# EAGLE design IO_module (EAGLE 7.2.0)
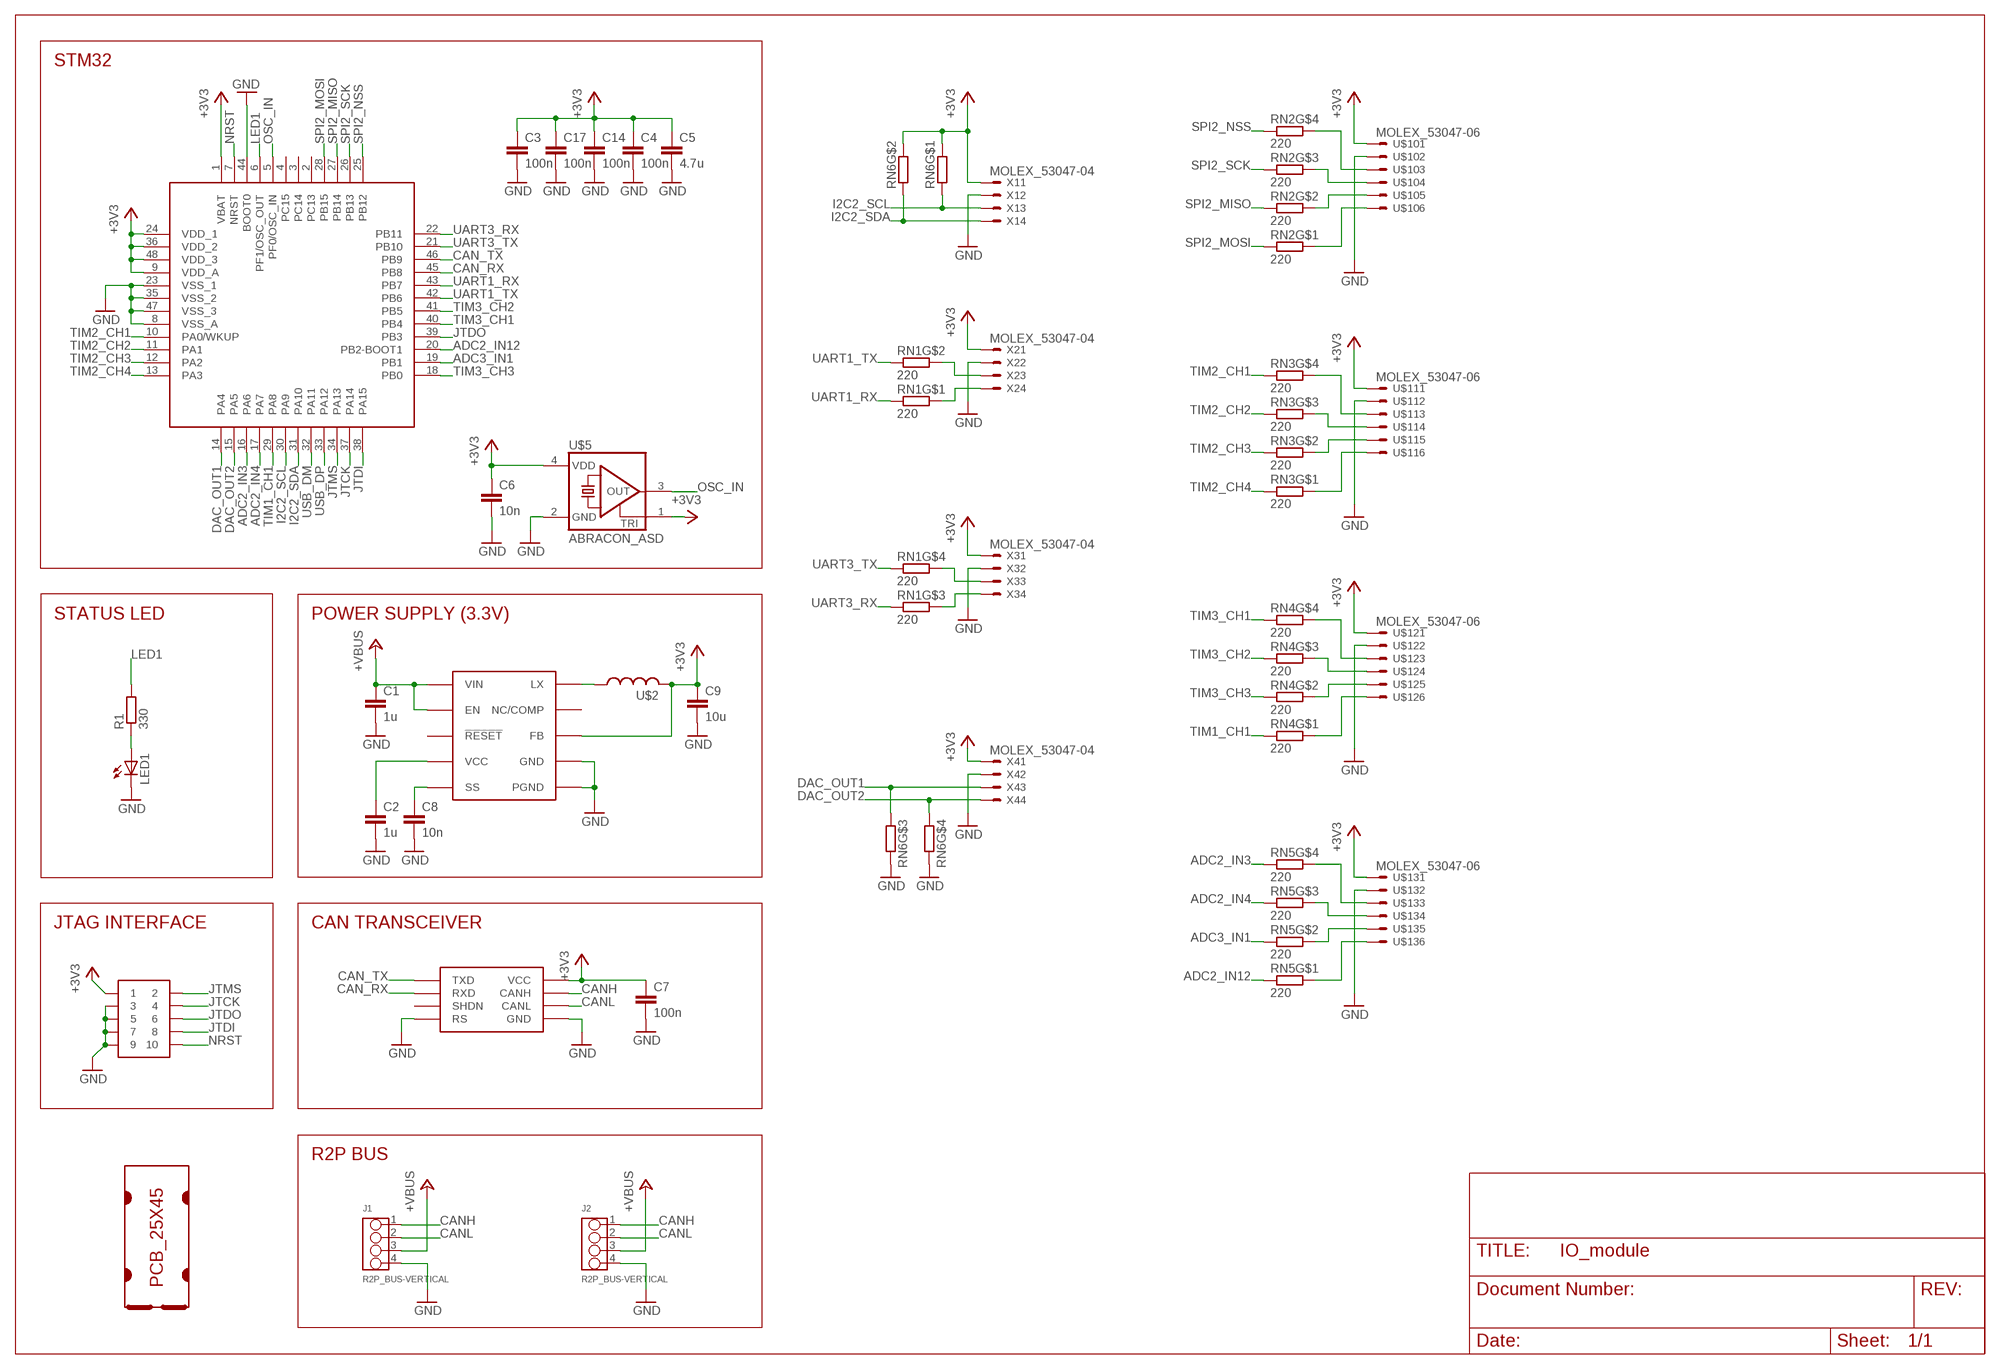
[diagram p0: schematic, sheet 1]

## Parts
C1  1u  C1206  [C1206]
C2  1u  C0603  [C0603]
C3  100n  C0603  [C0603]
C4  100n  C0603  [C0603]
C5  4.7u  C0805  [C0805]
C6  10n  C0603  [C0603]
C7  100n  C0603  [C0603]
C8  10n  C0603  [C0603]
C9  10u  C0805  [C0805]
C14  100n  C0603  [C0603]
C17  100n  C0603  [C0603]
J1  R2P_BUS-VERTICAL  [OPL-EAGLE-LIBRARY_4P-2.0]
J2  R2P_BUS-VERTICAL  [OPL-EAGLE-LIBRARY_4P-2.0]
LED1  LED0805  [CHIPLED_0805]
R1  330  R0603  [R0603]
RN1  220  RNETWORK_4-1206  [RNET4_1206]
RN2  220  RNETWORK_4-1206  [RNET4_1206]
RN3  220  RNETWORK_4-1206  [RNET4_1206]
RN4  220  RNETWORK_4-1206  [RNET4_1206]
RN5  220  RNETWORK_4-1206  [RNET4_1206]
RN6  RNETWORK_4-1206  [RNET4_1206]
SOT1  MAX3051EKA  [SOT23-8L]
U$1  PCB_25X45  [25X45]
U$2  LPS4018  [COILCRAFT_LPS4018]
U$3  MAX17501  [TDFN-10]
U$4  JTAG-TH  [SAMTEC_FTSH-105-TH]
U$5  ABRACON_ASD  [ABRACON_2.5X2]
U$6  STM32F303CTX  [LQFP48]
U$10  MOLEX_53047-06  [MOLEX_53047-06]
U$11  MOLEX_53047-06  [MOLEX_53047-06]
U$12  MOLEX_53047-06  [MOLEX_53047-06]
U$13  MOLEX_53047-06  [MOLEX_53047-06]
X1  MOLEX_53047-04  [MOLEX_53047-04]
X2  MOLEX_53047-04  [MOLEX_53047-04]
X3  MOLEX_53047-04  [MOLEX_53047-04]
X4  MOLEX_53047-04  [MOLEX_53047-04]

## Nets
+3V3: C3.1 C4.1 C5.1 C6.1 C7.1 C9.1 C14.1 C17.1 RN6.7 RN6.8 SOT1.3(VCC) U$2.P$2 U$3.P$5(FB) U$4.1 U$5.1(TRI) U$5.4(VDD) U$6.1(VBAT) U$6.9(VDD_A) U$6.24(VDD_1) U$6.36(VDD_2) U$6.48(VDD_3) U$10.1 U$11.1 U$12.1 U$13.1 X1.1 X2.1 X3.1 X4.1
+VBUS: C1.1 J1.3 J2.3 U$3.P$2(VIN) U$3.P$3(EN)
ADC2_IN3: RN5.4 U$6.16(PA6)
ADC2_IN4: RN5.3 U$6.17(PA7)
ADC2_IN12: RN5.1 U$6.20(PB2-BOOT1)
ADC3_IN1: RN5.2 U$6.19(PB1)
CAN_RX: SOT1.4(RXD) U$6.45(PB8)
CAN_TX: SOT1.1(TXD) U$6.46(PB9)
CANH: J1.1 J2.1 SOT1.7(CANH)
CANL: J1.2 J2.2 SOT1.6(CANL)
DAC_OUT1: RN6.3 U$6.14(PA4) X4.3
DAC_OUT2: RN6.4 U$6.15(PA5) X4.4
GND: C1.2 C2.2 C3.2 C4.2 C5.2 C6.2 C7.2 C8.2 C9.2 C14.2 C17.2 J1.4 J2.4 LED1.C RN6.5 RN6.6 SOT1.2(GND) SOT1.8(RS) U$3.P$1(PGND) U$3.P$9(GND) U$3.P$11(PGND) U$4.3 U$4.5 U$4.7 U$4.9 U$5.2(GND) U$6.8(VSS_A) U$6.23(VSS_1) U$6.35(VSS_2) U$6.44(BOOT0) U$6.47(VSS_3) U$10.2 U$11.2 U$12.2 U$13.2 X1.2 X2.2 X3.2 X4.2
I2C2_SCL: RN6.1 U$6.30(PA9) X1.3
I2C2_SDA: RN6.2 U$6.31(PA10) X1.4
JTCK: U$4.4 U$6.37(PA14)
JTDI: U$4.8 U$6.38(PA15)
JTDO: U$4.6 U$6.39(PB3)
JTMS: U$4.2 U$6.34(PA13)
LED1: R1.2 U$6.6(PF1/OSC_OUT)
N$1: U$2.P$1 U$3.P$10(LX)
N$3: RN1.5 X3.3
N$4: LED1.A R1.1
N$5: RN1.7 X2.3
N$6: RN1.8 X2.4
N$7: C2.1 U$3.P$4(VCC)
N$8: C8.1 U$3.P$6(SS)
N$11: RN1.6 X3.4
N$12: RN2.8 U$10.6
N$13: RN2.7 U$10.5
N$14: RN2.6 U$10.4
N$15: RN2.5 U$10.3
N$18: RN5.8 U$13.6
N$19: RN5.7 U$13.5
N$20: RN5.6 U$13.4
N$21: RN5.5 U$13.3
N$22: RN4.5 U$12.3
N$23: RN4.6 U$12.4
N$24: RN4.7 U$12.5
N$25: RN4.8 U$12.6
N$26: RN3.5 U$11.3
N$27: RN3.6 U$11.4
N$28: RN3.7 U$11.5
N$29: RN3.8 U$11.6
NRST: U$4.10 U$6.7(NRST)
OSC_IN: U$5.3(OUT) U$6.5(PF0/OSC_IN)
SPI2_MISO: RN2.2 U$6.27(PB14)
SPI2_MOSI: RN2.1 U$6.28(PB15)
SPI2_NSS: RN2.4 U$6.25(PB12)
SPI2_SCK: RN2.3 U$6.26(PB13)
TIM1_CH1: RN4.1 U$6.29(PA8)
TIM2_CH1: RN3.4 U$6.10(PA0/WKUP)
TIM2_CH2: RN3.3 U$6.11(PA1)
TIM2_CH3: RN3.2 U$6.12(PA2)
TIM2_CH4: RN3.1 U$6.13(PA3)
TIM3_CH1: RN4.4 U$6.40(PB4)
TIM3_CH2: RN4.3 U$6.41(PB5)
TIM3_CH3: RN4.2 U$6.18(PB0)
UART1_RX: RN1.1 U$6.43(PB7)
UART1_TX: RN1.2 U$6.42(PB6)
UART3_RX: RN1.3 U$6.22(PB11)
UART3_TX: RN1.4 U$6.21(PB10)
USB_DM: U$6.32(PA11)
USB_DP: U$6.33(PA12)
Unconnected: SOT1.5(SHDN) U$3.P$7(NC/COMP) U$3.P$8(!RESET) U$6.2(PC13) U$6.3(PC14) U$6.4(PC15)

## Notes on the sheet
- STM32
- STATUS LED | POWER SUPPLY (3.3V)
- JTAG INTERFACE | CAN TRANSCEIVER
- R2P BUS

## Library data of the parts
C1-C9 C14 C17 = r2p_rcl:C
J1 J2 = r2p_connector:R2P_BUS
LED1 = r2p_led:LED
R1 = r2p_rcl:R
RN1-RN6 = r2p_rcl:RNETWORK_4: 4 Resistor Array 0603
SOT1 = r2p_ic:MAX3051
U$1 = r2p_pcb:PCB_25X45
U$2 = r2p_rcl:LPS4018
U$3 = r2p_ic:MAX17501
U$4 = r2p_connector:JTAG
U$5 = r2p_ic:ABRACON_ASD
U$6 = r2p_ic:STM32F303C
U$10-U$13 = r2p_connector:MOLEX_53?-06
X1-X4 = r2p_connector:MOLEX_53?-04: CONNECTOR wire to board 1.25 mm (.049 inch) pitch header; MF: WALDOM/MOLEX; MPN: 53047-0410; OC_FARNELL: 9733060; OC_NEWARK: 38C9900

## Board
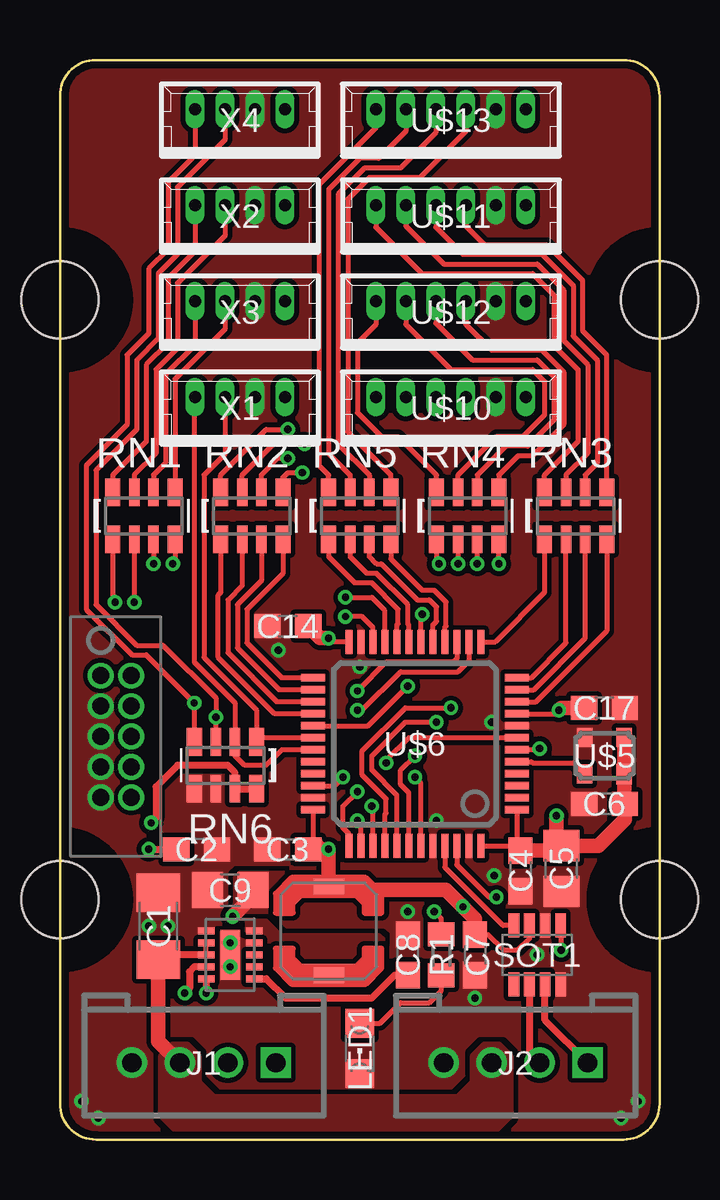
[diagram p1: board, top side]
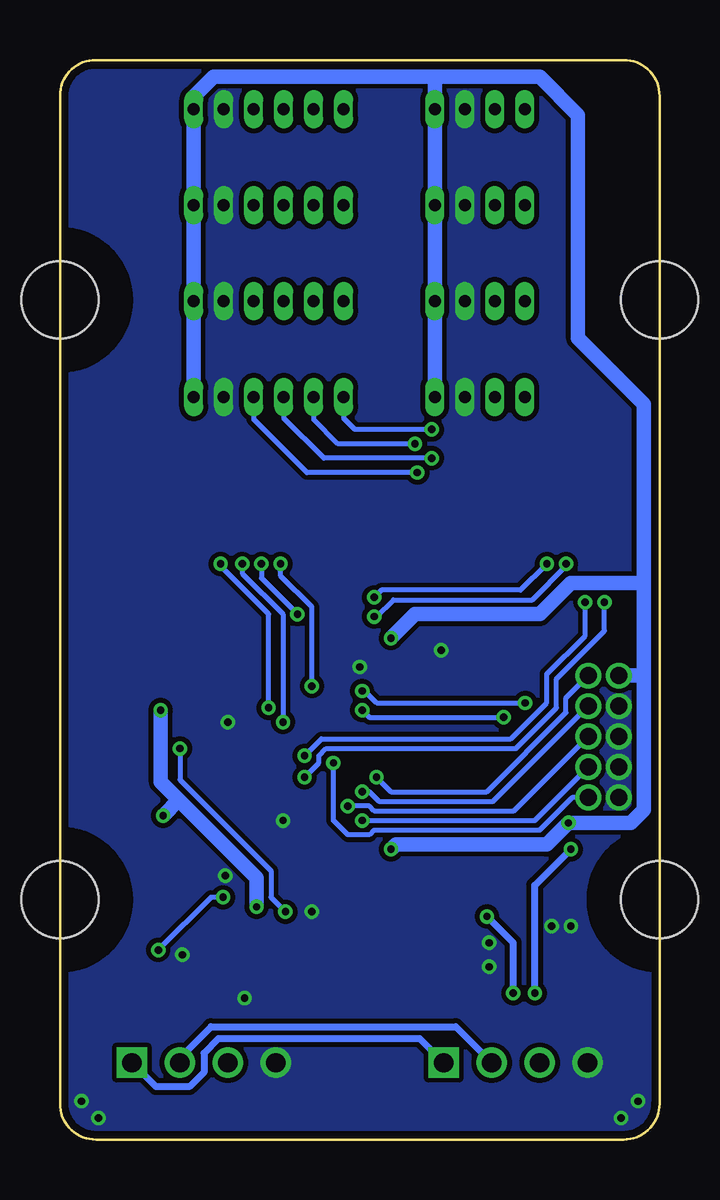
[diagram p2: board, bottom side, seen from below]

Size 25 x 45 mm. Coordinates in mm from the lower left corner, seen from the top.
Copper layers (1*16): Top 0.035mm / dielectric 1.5mm / Bottom 0.035mm
Design rules "2layer_0.2mm": minimum track width 0.2mm, minimum drill 0.3mm, track to track 0.2mm, track to pad 0.2mm, pad to pad 0.2mm, via to via 0.2mm, smd to smd 0mil, copper to edge 0.3mm, drill to drill 0.3mm, minimum pad ring 0.15mm, minimum via ring 0.15mm, stop-mask expansion 0.05mm, vias tented up to drill 2.5mm, thermal gap 0.25mm
tRestrict: 2 lines

### Footprints (pad centres in the part's own frame; a part is rotated, then mirrored left to right if it is on the bottom)
C1206 = smd 1.6 x 1.8: 1 -1.4,0; 2 1.4,0
C0603 = smd 1.1 x 1: 1 -0.85,0; 2 0.85,0
C0805 = smd 1.3 x 1.5: 1 -0.95,0; 2 0.95,0
OPL-EAGLE-LIBRARY_4P-2.0 = drill 0.8 pad 1.27 square: 1 -3,0 | drill 0.8 pad 1.27: 2 -1,0; 3 1,0; 4 3,0
CHIPLED_0805 = smd 1.2 x 1.2: A 0,-1.05; C 0,1.05
R0603 = smd 1 x 1.1: 1 -0.85,0; 2 0.85,0
RNET4_1206 = smd 0.63 x 1.15: 1 -1.295,-0.975; 4 1.295,-0.975; 5 1.295,0.975; 8 -1.295,0.975 | smd 0.44 x 1.15: 2 -0.4,-0.975; 3 0.4,-0.975; 6 0.4,0.975; 7 -0.4,0.975
SOT23-8L = smd 0.45 x 1: 1 -0.975,-1.225; 2 -0.325,-1.225; 3 0.325,-1.225; 4 0.975,-1.225; 5 0.975,1.225; 6 0.325,1.225; 7 -0.325,1.225; 8 -0.975,1.225
25X45 = hole 3.2: 0,10; 25,10; 0,35; 25,35
COILCRAFT_LPS4018 = smd 0.635 x 1.27: P$1 -1.85,0; P$2 1.85,0
TDFN-10 = smd 0.7 x 0.3: P$1 -1,1; P$2 -1,0.5; P$3 -1,0; P$4 -1,-0.5; P$5 -1,-1; P$6 1,-1; P$7 1,-0.5; P$8 1,0; P$9 1,0.5; P$10 1,1 | smd 0.8 x 2.08: P$11 0,0
SAMTEC_FTSH-105-TH = drill 0.711 pad 1.016: 1 -2.54,0; 2 -2.54,1.27; 3 -1.27,0; 4 -1.27,1.27; 5 0,0; 6 0,1.27; 7 1.27,0; 8 1.27,1.27; 9 2.54,0; 10 2.54,1.27
ABRACON_2.5X2 = smd 0.65 x 0.8: 1 -0.825,-0.762; 2 0.825,-0.762; 3 0.825,0.762 | smd 0.65 x 0.85: 4 -0.825,0.762
LQFP48 = smd 1 x 0.3: 1 -4.25,2.75; 2 -4.25,2.25; 3 -4.25,1.75; 4 -4.25,1.25; 5 -4.25,0.75; 6 -4.25,0.25; 7 -4.25,-0.25; 8 -4.25,-0.75; 9 -4.25,-1.25; 10 -4.25,-1.75; 11 -4.25,-2.25; 12 -4.25,-2.75; 25 4.25,-2.75; 26 4.25,-2.25; 27 4.25,-1.75; 28 4.25,-1.25; 29 4.25,-0.75; 30 4.25,-0.25; 31 4.25,0.25; 32 4.25,0.75; 33 4.25,1.25; 34 4.25,1.75; 35 4.25,2.25; 36 4.25,2.75 | smd 0.3 x 1: 13 -2.75,-4.25; 14 -2.25,-4.25; 15 -1.75,-4.25; 16 -1.25,-4.25; 17 -0.75,-4.25; 18 -0.25,-4.25; 19 0.25,-4.25; 20 0.75,-4.25; 21 1.25,-4.25; 22 1.75,-4.25; 23 2.25,-4.25; 24 2.75,-4.25; 37 2.75,4.25; 38 2.25,4.25; 39 1.75,4.25; 40 1.25,4.25; 41 0.75,4.25; 42 0.25,4.25; 43 -0.25,4.25; 44 -0.75,4.25; 45 -1.25,4.25; 46 -1.75,4.25; 47 -2.25,4.25; 48 -2.75,4.25
MOLEX_53047-06 = drill 0.5 pad 0.698 long: 1 3.125,0.45; 2 1.875,0.45; 3 0.625,0.45; 4 -0.625,0.45; 5 -1.875,0.45; 6 -3.125,0.45
MOLEX_53047-04 = drill 0.5 pad 0.698 long: 1 1.875,0.45; 2 0.625,0.45; 3 -0.625,0.45; 4 -1.875,0.45

### Placement (x,y rotation side)
C1  4.1,8.9 90 top
C2  5.7,12.1 0 top
C3  9.5,12.1 180 top
C4  19.2,11.2 270 top
C5  20.9,11.3 270 top
C6  22.7,14 180 top
C7  17.3,7.7 270 top
C8  14.5,7.7 90 top
C9  7.1,10.4 180 top
C14  9.5,21.4 180 top
C17  22.7,18 0 top
J1  6,3.2 180 top
J2  19,3.2 180 top
LED1  12.5,3.8 180 top
R1  15.9,7.7 90 top
RN1  3.5,26 0 top
RN2  8,26 0 top
RN3  21.5,26 0 top
RN4  17,26 0 top
RN5  12.5,26 0 top
RN6  6.9,15.6 180 top
SOT1  19.9,7.7 180 top
U$1  0,0 0 top
U$2  11.2,8.7 90 top
U$3  7.1,7.7 0 top
U$4  1.7,16.8 270 top
U$5  22.7,16 180 top
U$6  14.8,16.5 180 top
U$10  16.3,30.5 0 top
U$11  16.3,38.5 0 top
U$12  16.3,34.5 0 top
U$13  16.3,42.5 0 top
X1  7.5,30.5 0 top
X2  7.5,38.5 0 top
X3  7.5,34.5 0 top
X4  7.5,42.5 0 top

### Tracks (layer width: path | path; a pad name or v marks a point on that pad's centre or on a via)
+3V3  (via drill 0.3)
  Top 0.2: C7.1 17.85,8.55 18.5,7.9 19.1,7.9 19.57,8.38 SOT1.3 | U$6.36 10.55,12.3 C3.1 | U$6.48 19,12.25 19.05,12.2 | U$6.1 19.05,12.2 | 19.05,12.2 C4.1 | U$6.24 11.35,20.75 v11.2,20.9 | U$6.9 20.65,17.75 v20.8,17.9 | C17.1 22,18
  Top 0.3: U$3.P$5 v6.1,6.1 | v3.8,13.2 4,13.4 4,14.7 4.9,15.6 7,15.6 7.3,15.3 RN6.7 RN6.8
  Top 0.6: 10.55,12.3 10.7,12.3 | C7.1 17.3,9.2 v16.8,9.7 16.1,10.4 12.6,10.4 | C3.1 v11.2,12.1 U$2.P$2 | U$5.1 U$5.4 23.52,14.03 C6.1 23.55,13.35 22.45,12.25 C5.1 | C4.1 20.7,12.05 C5.1 | 19.05,12.2 19.05,12.05 19,12 | C17.1 20.9,18 v20.8,17.9 | C5.1 20.7,12.45 v20.7,13.5 | v7.2,9.3 8.05,10.15 C9.1 | C14.1 10.85,20.9 v11.2,20.9
  Bottom 0.3: v6.1,6.1 6.1,8.2 v7.2,9.3
  Bottom 0.6: v11.2,12.1 11,12.3 4.7,12.3 v3.8,13.2 1.2,13.2 0.65,13.75 0.65,19.4 | 20.05,14.15 16.8,10.9 v16.8,9.7 | v20.7,13.5 20.05,14.15 | 20.05,14.15 20.8,14.9 v20.8,17.9 | 0.65,19.4 0.65,23.2 | 0.65,23.2 0.65,30.65 3.4,33.4 3.4,42.7 5,44.3 9.4,44.3 | 9.4,44.3 18.6,44.3 19.43,43.48 U$13.1 U$11.1 U$12.1 U$10.1 | 9.4,44.3 9.38,44.27 X4.1 X2.1 X3.1 X1.1 | U$4.1 0.71,19.34 0.65,19.4 | v11.2,20.9 10.2,21.9 5,21.9 3.7,23.2 0.65,23.2
  pour Top (rank 5, no thermals): 13.3,8.9 13.5,9.1 13.5,10.3 12.8,11 9.5,11 9.4,11.1 7.5,11.1 7.3,10.9 7.3,9.8 8.3,8.9
+VBUS
  Top 0.2: U$3.P$3 U$3.P$2
  Top 0.3: U$3.P$3 4.3,7.7 C1.1
  Top 0.6: C1.1 4.1,4.1 J1.3
  pour Top (no thermals): 4.7,4 5.3,4 5.8,3.5 5.8,2.4 6.4,1.8 16.6,1.8 17.2,2.4 17.2,3.5 17.7,4 18.3,4 18.8,3.5 18.8,1 17.8,0 5.2,0 4.2,1 4.2,3.5
ADC2_IN3
  Top 0.2: U$6.16 16.05,21.35 16.1,21.4 16.1,22.4 15.6,22.9 15.1,22.9 13.79,24.2 RN5.4
ADC2_IN4
  Top 0.2: U$6.17 15.55,21.45 15.7,21.6 15.7,22.2 15.4,22.5 14.9,22.5 13.4,24 13.2,24 12.9,24.3 RN5.3
ADC2_IN12
  Top 0.2: RN5.1 11.21,24.3 12.3,23.2 13,23.2 14.1,22.1 14.1,21.5 14.05,21.45 U$6.20
ADC3_IN1
  Top 0.2: U$6.19 14.55,21.45 14.5,21.5 14.5,22.3 13.2,23.6 12.8,23.6 12.1,24.3 RN5.2
CAN_RX
  Top 0.2: U$6.45 16.05,11.35 18.4,9 18.48,8.93 SOT1.4
CAN_TX  (via drill 0.3)
  Top 0.2: U$6.46 16.55,11.45 17.9,10.1 v18.2,10.1 | SOT1.1 20.88,7.92 v20.9,7.9
  Bottom 0.2: v18.2,10.1 18.7,10.1 v20.9,7.9
CANH
  Top 0.3: J2.1 20.23,4.97 SOT1.7
  Bottom 0.3: J1.1 10,4.2 18.4,4.2 19,3.6 19,2.8 19.6,2.2 21,2.2 J2.1
CANL
  Top 0.3: 19.57,3.62 J2.2 19.57,3.62 | SOT1.6 19.57,3.62
  Bottom 0.3: J1.2 8.5,4.7 18.7,4.7 20,3.4 J2.2
DAC_OUT1  (via drill 0.3)
  Top 0.2: X4.3 6.88,41.67 4.9,39.7 4.9,36.9 4.1,36.1 4.1,33.4 3.2,32.5 3.2,29.6 1.5,27.9 1.5,22.3 3.2,20.6 4.3,20.6 6.5,18.4 v6.5,17.6 RN6.3 | U$6.14 17.05,19.95 16.6,19.5 14.2,19.5 12.6,17.9 v12.4,17.9
  Bottom 0.2: v12.4,17.9 12.1,17.6 v6.5,17.6
DAC_OUT2  (via drill 0.3)
  Top 0.2: X4.4 5.62,41.02 4.5,39.9 4.5,37.1 3.7,36.3 3.7,33.6 2.8,32.7 2.8,29.8 1.1,28.1 1.1,22.1 3,20.2 3.6,20.2 v5.6,18.2 v5.61,18.2 RN6.4 | U$6.15 16.55,20.05 16.4,19.9 13.6,19.9 v12.4,18.7
  Bottom 0.2: v12.4,18.7 12.3,18.7 11.8,18.2 v5.6,18.2
GND  (via drill 0.3)
  other vias: 7.1,8.2 7.1,7.2 4.5,8.9 3.7,8.9 17.3,5.9 19.9,7.7 24.1,1.6 23.4,0.9 1.6,0.9 0.9,1.6 18,17.4 18.1,11 14.5,9.5 12.5,19.7 15.7,13.3 9.1,20.4
  pour Bottom (rank 6, no thermals): 0,0 25,0 25,45 0,45
  pour Top (rank 6, no thermals): 0,0 25,0 25,45 0,45
I2C2_SCL
  Top 0.2: X1.3 6.88,28.57 6,27.7 6,20.1 8.2,17.91 RN6.1 8.37,16.75 U$6.30
I2C2_SDA
  Top 0.2: X1.4 5.6,30.93 5.6,19.9 7.3,18.2 RN6.2 7.3,16 7.7,15.6 8.6,15.6 9.25,16.25 U$6.31
JTCK  (via drill 0.3)
  Top 0.2: U$6.37 12.05,12.75 11.8,13 11.8,13.9 v12.4,14.5
  Bottom 0.2: v12.4,14.5 12.1,14.5 11.7,14.1 6.94,14.1 U$4.4
JTDI  (via drill 0.3)
  Top 0.2: U$6.38 12.55,13.15 v12.4,13.3
  Bottom 0.2: v12.4,13.3 5.2,13.3 U$4.8
JTDO  (via drill 0.3)
  Top 0.2: U$6.39 13.05,13.85 v13,13.9
  Bottom 0.2: v13,13.9 12.1,13.9 11.9,13.7 6.07,13.7 U$4.6
JTMS  (via drill 0.3)
  Top 0.2: U$6.34 11.45,14.75 v11.8,15.1
  Bottom 0.2: v11.8,15.1 11.2,14.5 7.2,14.5 3.9,17.8 3.9,18.41 U$4.2
LED1  (via drill 0.3)
  Top 0.2: v20,16.3 19.95,16.25 U$6.6 | R1.2 15.9,9.2 v15.6,9.5
  Bottom 0.2: v20,16.3 20,15 16.2,11.2 16.2,10.1 v15.6,9.5
N$1
  pour Top (no thermals): 7.8,8.7 8.2,8.7 8.5,8.2 8.5,7.5 9.6,6.4 12.8,6.4 13.5,7.1 13.5,8.3 13.3,8.5 9.2,8.5 8.6,9.1 7.8,9.1
N$3
  Top 0.2: X3.3 6.88,33.77 4.8,31.7 RN1.5
N$4
  Top 0.2: R1.1 15.9,6.2 15.4,5.7 14.2,5.7 13.35,4.85 LED1.A
N$5
  Top 0.2: X2.3 6.88,37.67 4.9,35.7 4.9,33 4,32.1 4,28.6 3.1,27.7 RN1.7
N$6
  Top 0.2: X2.4 5.62,37.02 4.5,35.9 4.5,33.2 3.6,32.3 3.6,29.1 2.2,27.7 RN1.8
N$7  (via drill 0.3)
  Top 0.3: U$3.P$4 5.6,7.2 5.4,7 5.4,6.3 v5.2,6.1 | v3.7,12.1 C2.1
  Bottom 0.3: v5.2,6.1 5.2,10.6 v3.7,12.1
N$8
  Top 0.3: U$3.P$6 8.6,6.7 9.4,5.9 13,5.9 13.95,6.85 C8.1
N$11
  Top 0.2: X3.4 5.62,33.12 4.4,31.9 4.4,28.2 3.9,27.7 RN1.6
N$12  (via drill 0.3)
  Top 0.2: RN2.8 6.71,27.7 8.6,29.6 v9.5,29.6
  Bottom 0.2: v9.5,29.6 12.7,29.6 13.18,30.07 U$10.6
N$13  (via drill 0.3)
  Top 0.2: RN2.7 7.6,27.7 8.9,29 v10.2,29
  Bottom 0.2: v10.2,29 13.4,29 14.43,30.02 U$10.5
N$14  (via drill 0.3)
  Top 0.2: RN2.6 8.4,27.7 9.1,28.4 v9.5,28.4
  Bottom 0.2: v9.5,28.4 14,28.4 15.68,30.07 U$10.4
N$15  (via drill 0.3)
  Top 0.2: RN2.5 9.29,27.59 9.5,27.8 v10.1,27.8
  Bottom 0.2: v10.1,27.8 14.7,27.8 16.93,30.02 U$10.3
N$18
  Top 0.2: U$13.6 13.18,42.17 10.8,39.8 10.8,28.1 11.21,27.7 RN5.8
N$19
  Top 0.2: U$13.5 14.43,42.02 13.3,40.9 12.5,40.9 11.2,39.6 11.2,28.6 12.1,27.7 RN5.7
N$20
  Top 0.2: U$13.4 15.68,41.98 14.2,40.5 12.7,40.5 11.6,39.4 11.6,29 12.9,27.7 RN5.6
N$21
  Top 0.2: U$13.3 16.93,42.02 15,40.1 12.9,40.1 12,39.2 12,29.5 13.79,27.7 RN5.5
N$22
  Top 0.2: U$12.3 16.93,33.98 18,32.9 20.1,32.9 21,32 21,29.8 19.7,28.5 19.1,28.5 18.3,27.7 RN4.5
N$23
  Top 0.2: U$12.4 15.68,34.02 17.2,32.5 19.9,32.5 20.6,31.8 20.6,30 19.5,28.9 18.6,28.9 17.4,27.7 RN4.6
N$24
  Top 0.2: RN4.7 16.6,27.7 18.2,29.3 19.3,29.3 20.2,30.2 20.2,31.6 19.7,32.1 16.3,32.1 14.43,33.98 U$12.5
N$25
  Top 0.2: RN4.8 15.71,27.7 14.1,29.3 13.4,29.3 12.4,30.3 12.4,33.2 13.18,33.98 U$12.6
N$26
  Top 0.2: U$11.3 16.93,38.08 17.7,37.3 20.3,37.3 21.8,35.8 21.8,33.7 22.8,32.7 RN3.5
N$27
  Top 0.2: U$11.4 15.68,38.02 16.8,36.9 20.1,36.9 21.4,35.6 21.4,33.5 22.4,32.5 22.4,28.2 21.9,27.7 RN3.6
N$28
  Top 0.2: U$11.5 14.43,38.08 16,36.5 19.9,36.5 21,35.4 21,33.3 22,32.3 22,28.6 21.1,27.7 RN3.7
N$29
  Top 0.2: RN3.8 20.2,27.7 21.6,29.1 21.6,32.1 20.6,33.1 20.6,35.2 19.7,36.1 15.1,36.1 13.18,38.02 U$11.6
NRST  (via drill 0.3)
  Top 0.2: U$6.7 14.55,16.75 13.6,15.8 v13.6,15.7
  Bottom 0.2: v13.6,15.7 13.6,13.3 13,12.7 12.1,12.7 11.9,12.9 5,12.9 3.64,14.26 U$4.10
OSC_IN
  Top 0.2: U$6.5 19.65,15.75 19.7,15.7 21.41,15.7 U$5.3
SPI2_MISO
  Top 0.2: RN2.2 7.6,23.1 7,22.5 7,20.3 9.05,18.25 U$6.27
SPI2_MOSI
  Top 0.2: U$6.28 8.95,17.75 6.6,20.1 6.6,22.7 6.71,22.8 RN2.1
SPI2_NSS
  Top 0.2: RN2.4 9.29,23.59 7.8,22.1 7.8,20.7 9.25,19.25 U$6.25
SPI2_SCK
  Top 0.2: RN2.3 8.4,23.3 7.4,22.3 7.4,20.5 9.15,18.75 U$6.26
TIM1_CH1  (via drill 0.3)
  Top 0.2: RN4.1 15.71,24.09 v15.8,24 | U$6.29 12.85,17.25 v14.5,18.9
  Bottom 0.2: v14.5,18.9 14.5,22.2 15.8,23.5 v15.8,24
TIM2_CH1
  Top 0.2: U$6.10 19.85,18.25 22.8,21.2 RN3.4
TIM2_CH2
  Top 0.2: U$6.11 19.75,18.75 21.9,20.9 RN3.3
TIM2_CH3
  Top 0.2: U$6.12 19.65,19.25 21.1,20.7 RN3.2
TIM2_CH4
  Top 0.2: RN3.1 20.2,22.8 18.15,20.75 U$6.13
TIM3_CH1  (via drill 0.3)
  Top 0.2: U$6.40 13.55,13.55 13.6,13.6 13.6,14.2 12.6,15.2 12.6,16.2 14.4,18 v16.3,18 | v18.3,24 RN4.4
  Bottom 0.2: v16.3,18 16.3,21.9 18.3,23.9 v18.3,24
TIM3_CH2  (via drill 0.3)
  Top 0.2: U$6.41 14.05,14.35 13,15.4 13,16 14.4,17.4 v15.7,17.4 | v17.4,24 RN4.3
  Bottom 0.2: v17.4,24 17.4,23.6 15.7,21.9 v15.7,17.4
TIM3_CH3  (via drill 0.3)
  Top 0.2: RN4.2 v16.6,24 | U$6.18 15.05,21.85 v15.1,21.9
  Bottom 0.2: v16.6,24 16.6,23.4 v15.1,21.9
UART1_RX  (via drill 0.3)
  Top 0.2: RN1.1 2.21,22.5 v2.3,22.4 | U$6.43 15.05,14.85 v14.8,15.1
  Bottom 0.2: v14.8,15.1 14.2,15.7 14.2,16 13.9,16.3 6,16.3 4.3,18 4.3,19.2 2.3,21.2 v2.3,22.4
UART1_TX  (via drill 0.3)
  Top 0.2: RN1.2 v3.1,22.4 | U$6.42 14.55,14.45 14.2,14.8 14.2,15.4 v14.8,16
  Bottom 0.2: v14.8,16 14.1,16.7 6.2,16.7 4.7,18.2 4.7,19.4 3.1,21 v3.1,22.4
UART3_RX  (via drill 0.3)
  Top 0.2: RN1.3 v3.9,24 | U$6.22 13.05,21.35 12.6,21.8 v11.9,21.8
  Bottom 0.2: v11.9,21.8 11.8,21.8 11.1,22.5 5.3,22.5 3.9,23.9 v3.9,24
UART3_TX  (via drill 0.3)
  Top 0.2: U$6.21 13.55,22.05 13,22.6 v11.9,22.6 | RN1.4 4.79,24.09 v4.7,24
  Bottom 0.2: v11.9,22.6 11.6,22.9 5.8,22.9 v4.7,24

### Text on the board
Document: DAC | ADC | U1 | D1 | U2 | D2 | I2C | SPI
200bmp: IO module / v1.0 (2015/02)